# EAGLE design untitled (EAGLE 9.6.1)
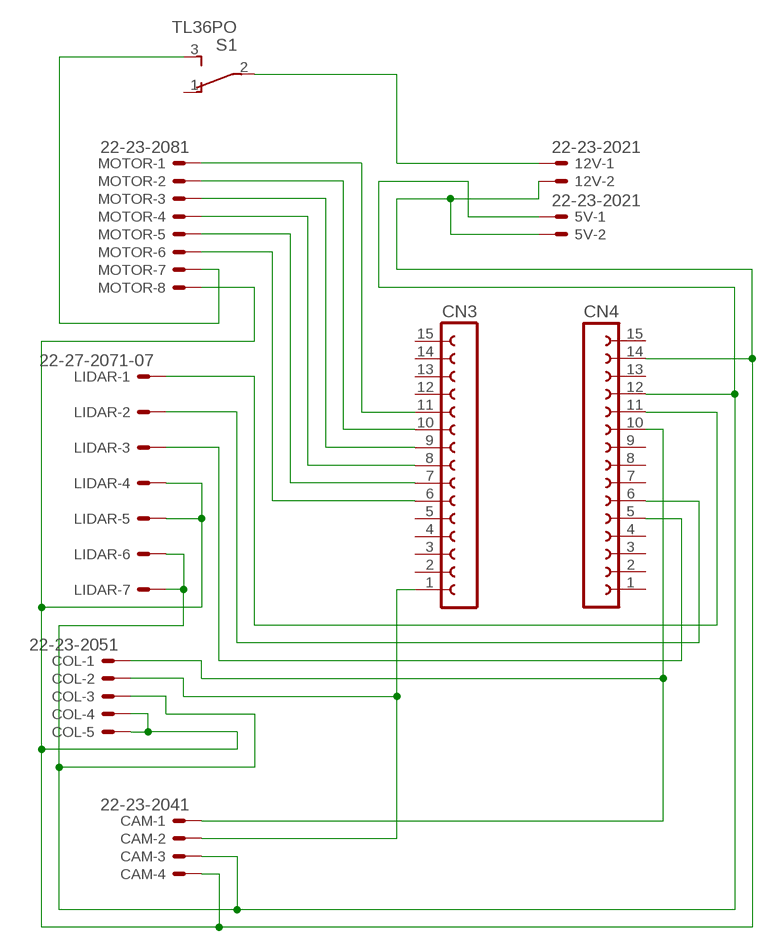
[diagram p0: schematic, sheet 1]

## Parts
5V  22-23-2021  [22-23-2021]
12V  22-23-2021  [22-23-2021]
CAM  22-23-2041  [22-23-2041]
CN3  FE15-1  [FE15]
CN4  FE15-1  [FE15]
COL  22-23-2051  [22-23-2051]
LIDAR  22-27-2071-07  [6410-07]
MOTOR  22-23-2081  [22-23-2081]
S1  TL36PO  [TL3XPO]

## Nets
N$1: 5V.2 12V.2 CAM.4 CN4.14 COL.4 COL.5 LIDAR.4 LIDAR.5 MOTOR.8
N$2: 5V.1 CAM.3 CN4.12 COL.3 LIDAR.6 LIDAR.7
N$3: CN3.11 MOTOR.1
N$4: CN3.9 MOTOR.3
N$6: CN3.8 MOTOR.4
N$7: MOTOR.7 S1.3(S)
N$8: 12V.1 S1.2(P)
N$9: CN3.7 MOTOR.5
N$10: CN3.6 MOTOR.6
N$11: CN4.11 LIDAR.1
N$12: CN4.6 LIDAR.2
N$13: CN4.5 LIDAR.3
N$14: CAM.1 CN4.10 COL.1
N$15: CAM.2 CN3.1 COL.2
N$16: CN3.10 MOTOR.2
Unconnected: CN3.2 CN3.3 CN3.4 CN3.5 CN3.12 CN3.13 CN3.14 CN3.15 CN4.1 CN4.2 CN4.3 CN4.4 CN4.7 CN4.8 CN4.9 CN4.13 CN4.15 S1.1(O)

## Library data of the parts
5V 12V = con-molex:22-23-2021: .100" (2.54mm) Center Header - 2 Pin; MF: MOLEX; MPN: 22-23-2021; OC_FARNELL: 1462926; OC_NEWARK: 25C3832
CAM = con-molex:22-23-2041: .100" (2.54mm) Center Header - 4 Pin; MF: MOLEX; MPN: 22-23-2041; OC_FARNELL: 1462920; OC_NEWARK: 38C0355
CN3 CN4 = con-lsta:FE15-1: FEMALE HEADER; OC_FARNELL: unknown; OC_NEWARK: unknown
COL = con-molex:22-23-2051: .100" (2.54mm) Center Header - 5 Pin; MF: MOLEX; MPN: 22-23-2051; OC_FARNELL: 1462952; OC_NEWARK: 38C9178
LIDAR = con-molex:22-?-07: CONNECTOR wire to board 2.54 mm (.1 inch) pitch header; MF: MOLEX; OC_FARNELL: unknown; OC_NEWARK: unknown
MOTOR = con-molex:22-23-2081: .100" (2.54mm) Center Header - 8 Pin; MF: MOLEX; MPN: 22-23-2081; OC_FARNELL: 1756826; OC_NEWARK: 01C7592
S1 = switch:TL36PO: TINY SWITCH ON - ON Source: http://www2.produktinfo.conrad.com/datenblaetter/700000-724999/705152-da-01-de-Subminiaturschalter_TL_36YO.pdf

## Board
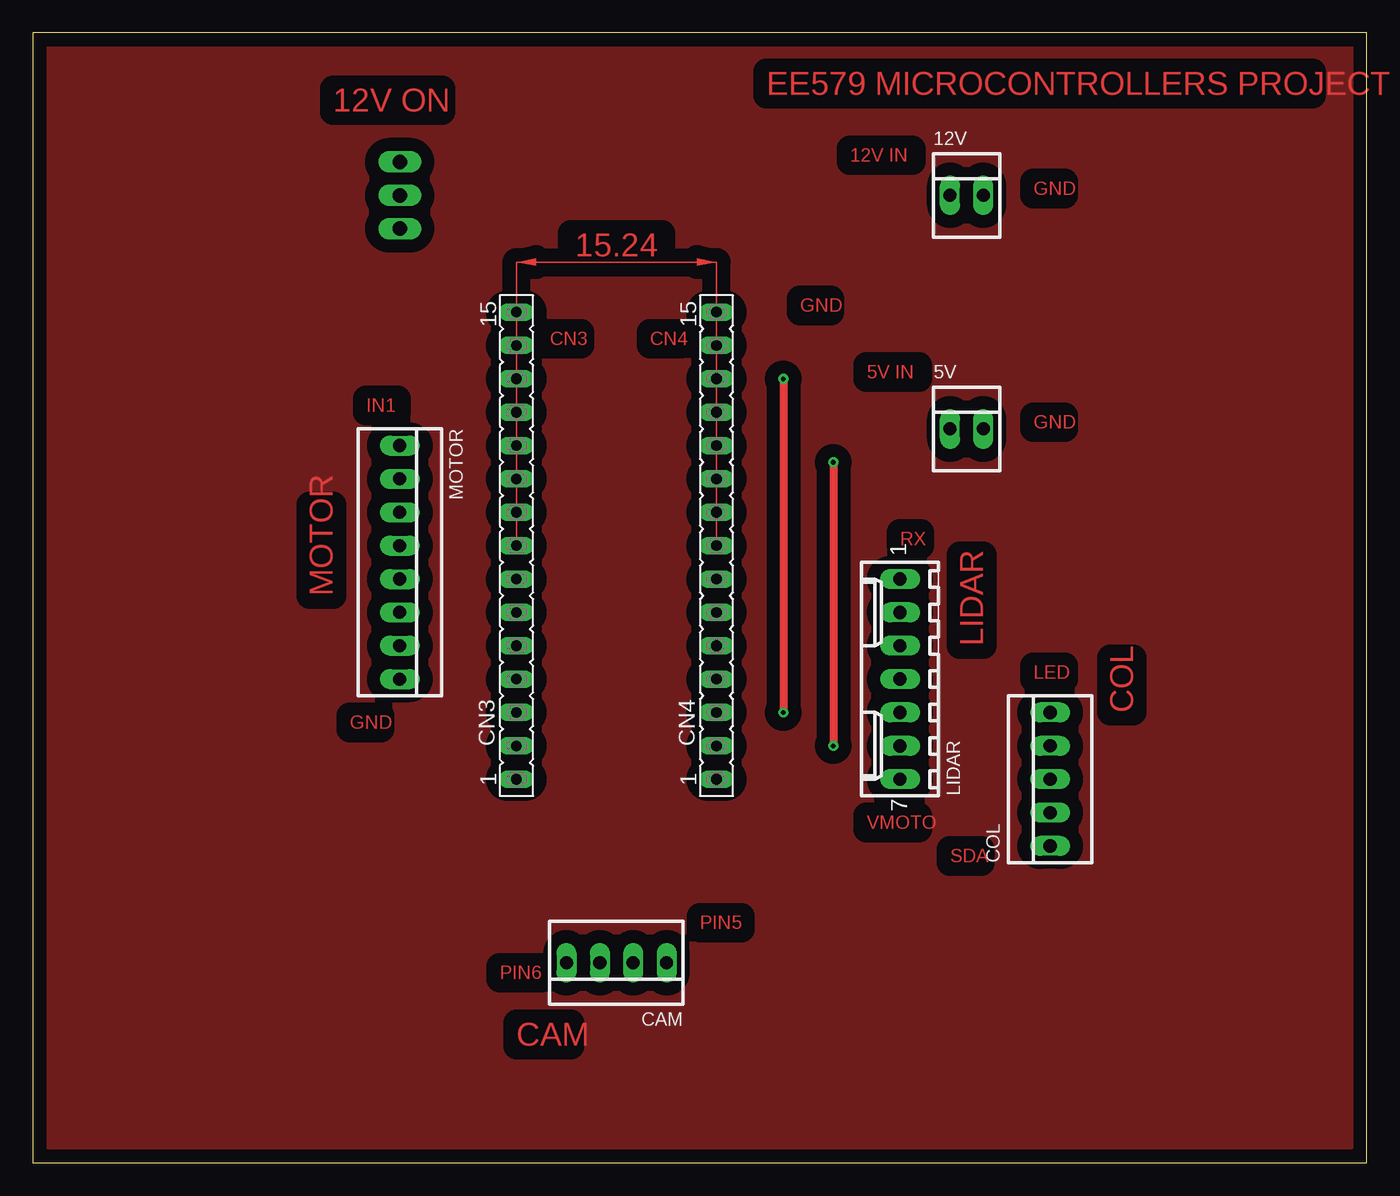
[diagram p1: board, top side]
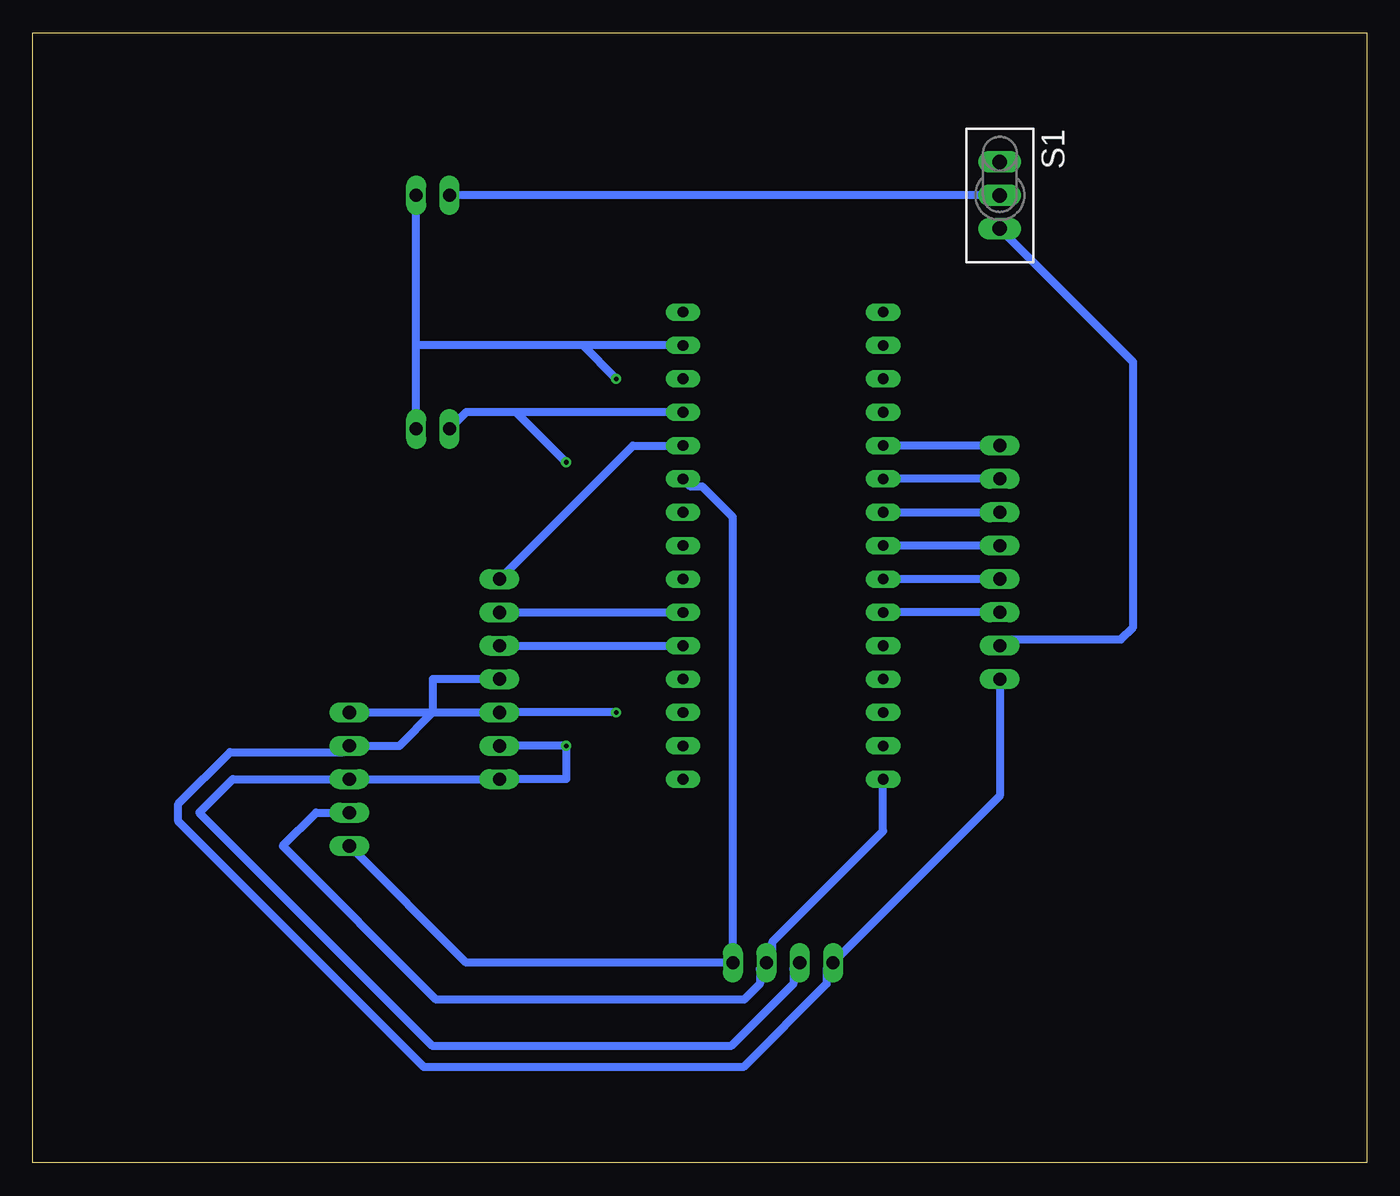
[diagram p2: board, bottom side, seen from below]

Size 101.58 x 86.03 mm. Coordinates in mm from the lower left corner, seen from the top.
Outline: 0,0 101.58,0 101.58,86.03 0,86.03 0,0
Copper layers (1*16): Top 0.035mm / dielectric 1.5mm / Bottom 0.035mm
Design rules "default *": minimum track width 0.6mm, minimum drill 0.1mm, track to track 1mm, track to pad 1mm, pad to pad 1mm, via to via 1mm, smd to smd 8mil, copper to edge 40mil, drill to drill 6mil, minimum pad ring 10mil, minimum via ring 8mil, stop-mask expansion 4mil, vias tented up to drill 0mil, thermal gap 10mil

### Footprints (pad centres in the part's own frame; a part is rotated, then mirrored left to right if it is on the bottom)
22-23-2021 = drill 1 long: 1 -1.27,0; 2 1.27,0
22-23-2041 = drill 1 long: 1 -3.81,0; 2 -1.27,0; 3 1.27,0; 4 3.81,0
FE15 = drill 0.813 long: 1 -17.78,0; 2 -15.24,0; 3 -12.7,0; 4 -10.16,0; 5 -7.62,0; 6 -5.08,0; 7 -2.54,0; 8 0,0; 9 2.54,0; 10 5.08,0; 11 7.62,0; 12 10.16,0; 13 12.7,0; 14 15.24,0; 15 17.78,0
22-23-2051 = drill 1 long: 1 -5.08,0; 2 -2.54,0; 3 0,0; 4 2.54,0; 5 5.08,0
6410-07 = drill 1.016 long: 1 7.62,0; 2 5.08,0; 3 2.54,0; 4 0,0; 5 -2.54,0; 6 -5.08,0; 7 -7.62,0
22-23-2081 = drill 1 long: 1 -8.89,0; 2 -6.35,0; 3 -3.81,0; 4 -1.27,0; 5 1.27,0; 6 3.81,0; 7 6.35,0; 8 8.89,0
TL3XPO = drill 1.1 pad 1.422 long: 1 -2.54,0; 2 0,0; 3 2.54,0

### Placement (x,y rotation side)
5V  71.12,55.88 0 top
12V  71.12,73.66 0 top
CAM  44.45,15.24 180 top
CN3  36.83,46.99 90 top
CN4  52.07,46.99 90 top
COL  77.47,29.21 90 top
LIDAR  66.04,36.83 90 top
MOTOR  27.94,45.72 270 top
S1  27.94,73.66 270 bottom

### Tracks (layer width: path | path; a pad name or v marks a point on that pad's centre or on a via)
GND
  pour Top: 1.27,85.09 100.33,85.09 100.33,1.27 1.27,1.27
N$1  (via drill 0.35)
  Top 0.6: v57.15,59.69 v57.15,34.29
  Bottom 0.6: MOTOR.8 27.94,27.94 CAM.4 41.13,14.75 41.13,13.63 47.47,7.29 71.78,7.29 90.5,26.01 90.5,27.33 86.57,31.26 77.96,31.26 COL.4 73.66,31.75 71.12,34.29 | COL.5 71.12,34.29 | 71.12,34.29 LIDAR.5 v57.15,34.29 | LIDAR.4 71.12,36.83 71.12,34.29 | 5V.2 72.39,62.23 | 72.39,62.23 12V.2 | CN4.14 59.69,62.23 | 59.69,62.23 72.39,62.23 | v57.15,59.69 59.69,62.23
N$2  (via drill 0.35)
  Top 0.6: v60.96,53.34 v60.96,31.75
  Bottom 0.6: CAM.3 43.67,14.75 43.67,13.63 48.41,8.89 71.12,8.89 88.9,26.67 86.36,29.21 COL.3 LIDAR.7 60.96,29.21 v60.96,31.75 LIDAR.6 | 5V.1 68.58,57.15 66.04,57.15 64.77,57.15 | CN4.12 64.77,57.15 | v60.96,53.34 64.77,57.15
N$3
  Bottom 0.6: MOTOR.1 CN3.11
N$4
  Bottom 0.6: CN3.9 MOTOR.3
N$6
  Bottom 0.6: MOTOR.4 CN3.8
N$7
  Bottom 0.6: MOTOR.7 27.45,39.86 18.71,39.86 17.78,40.79 17.78,60.96 S1.3
N$8
  Bottom 0.6: S1.2 12V.1
N$9
  Bottom 0.6: MOTOR.5 CN3.7
N$10
  Bottom 0.6: MOTOR.6 CN3.6
N$11
  Bottom 0.6: LIDAR.1 55.88,54.61 CN4.11
N$12
  Bottom 0.6: LIDAR.2 CN4.6
N$13
  Bottom 0.6: LIDAR.3 CN4.5
N$14
  Bottom 0.6: CN4.10 51.49,51.49 50.6,51.49 48.26,49.15 CAM.1 68.58,15.24 COL.1
N$15
  Bottom 0.6: CN3.1 36.83,25.25 45.23,16.84 45.23,15.73 CAM.2 46.21,14.75 46.21,13.63 47.41,12.43 70.85,12.43 82.55,24.13 80.01,26.67 COL.2
N$16
  Bottom 0.6: MOTOR.2 CN3.10
(copper drawn outside any net)
  shapes: Top area x1

### Text on the board
Top: EE579 MICROCONTROLLERS PROJECT | 12V ON | 12V IN | GND | GND | CN3 | CN4 | 5V IN | IN1 | GND | RX | MOTOR | LIDAR | LED | COL | GND | VMOTO | SDA | PIN5 | PIN6 | CAM